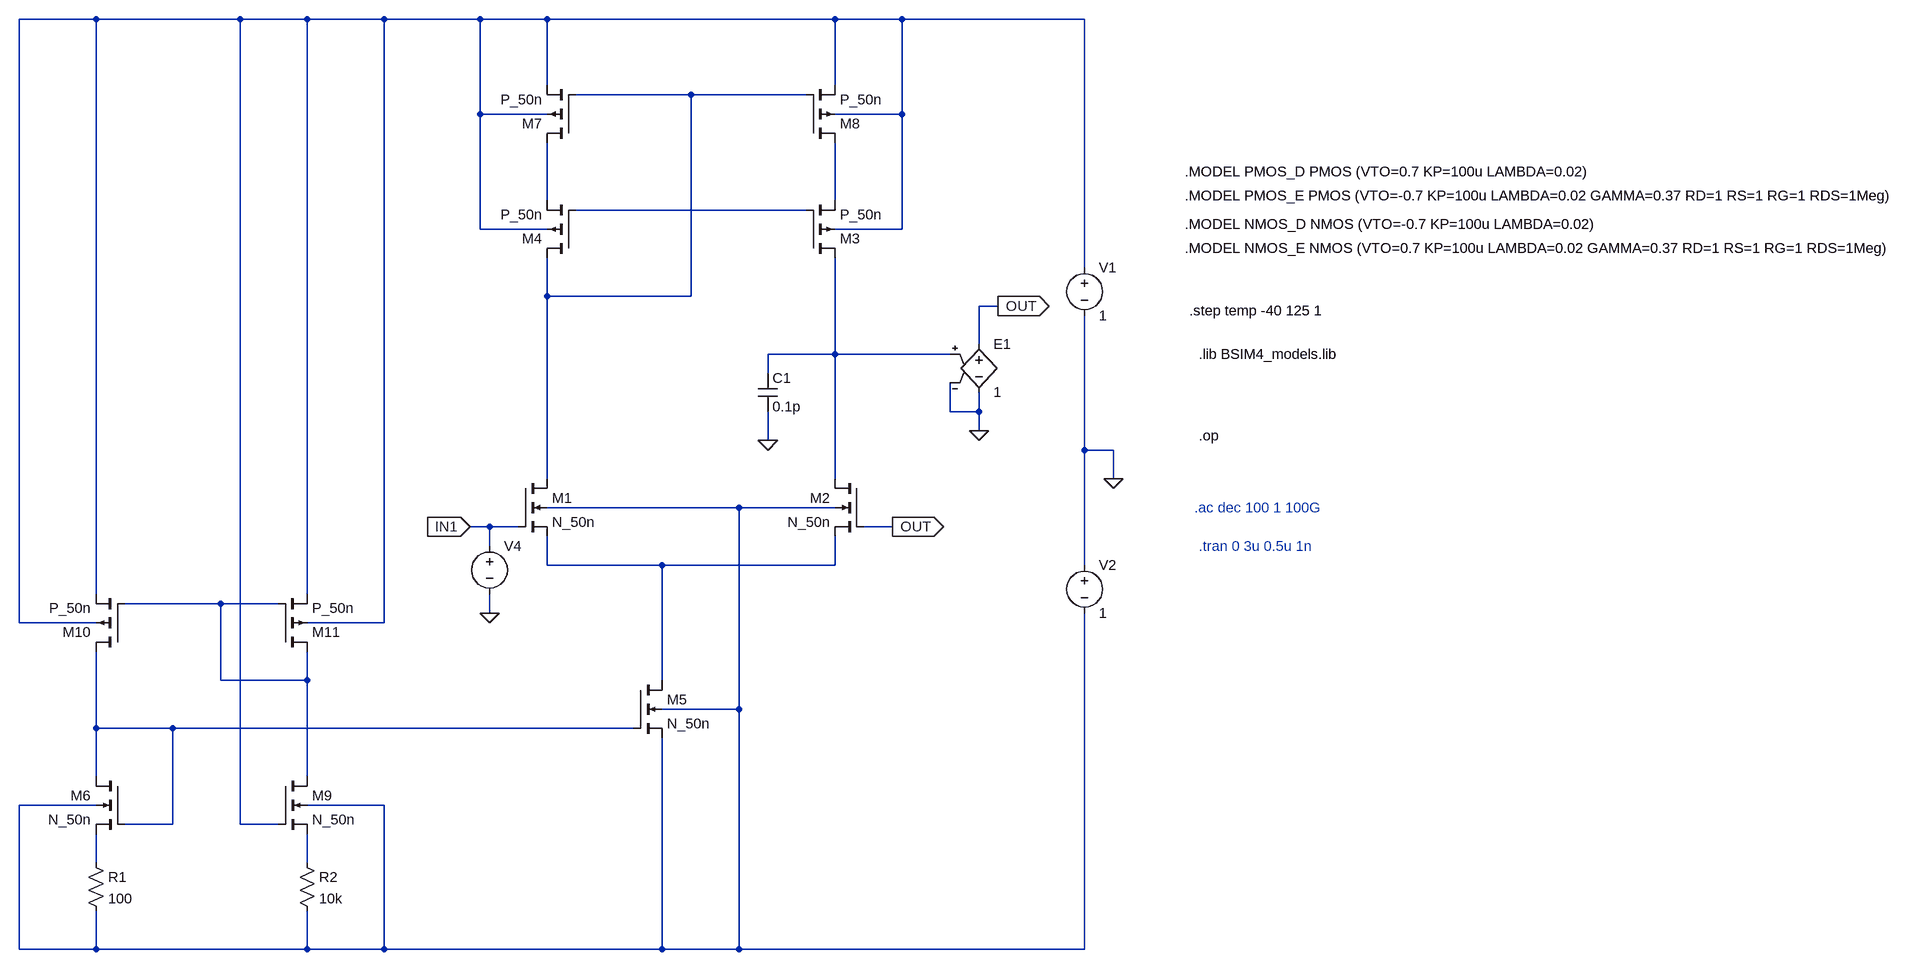
[diagram p0: schematic opamp_v3.asc]
opamp_v3.asc, the LTspice schematic file:
Version 4
SHEET 1 3416 1000
WIRE -736 -656 -864 -656
WIRE -496 -656 -736 -656
WIRE -384 -656 -496 -656
WIRE -256 -656 -384 -656
WIRE -96 -656 -256 -656
WIRE 16 -656 -96 -656
WIRE 496 -656 16 -656
WIRE 608 -656 496 -656
WIRE 912 -656 608 -656
WIRE 16 -496 16 -656
WIRE 496 -496 496 -656
WIRE 256 -480 64 -480
WIRE 448 -480 256 -480
WIRE -96 -448 -96 -656
WIRE 16 -448 -96 -448
WIRE 608 -448 608 -656
WIRE 608 -448 496 -448
WIRE 16 -304 16 -400
WIRE 496 -304 496 -400
WIRE 448 -288 64 -288
WIRE -96 -256 -96 -448
WIRE 16 -256 -96 -256
WIRE 608 -256 608 -448
WIRE 608 -256 496 -256
WIRE 912 -192 912 -656
WIRE 16 -144 16 -208
WIRE 256 -144 256 -480
WIRE 256 -144 16 -144
WIRE 768 -128 736 -128
WIRE 736 -64 736 -128
WIRE 496 -48 496 -208
WIRE 496 -48 384 -48
WIRE 688 -48 496 -48
WIRE 384 -16 384 -48
WIRE 688 48 688 0
WIRE 736 48 736 16
WIRE 736 48 688 48
WIRE 736 80 736 48
WIRE 384 96 384 48
WIRE 912 112 912 -112
WIRE 960 112 912 112
WIRE 16 160 16 -144
WIRE 496 160 496 -48
WIRE 960 160 960 112
WIRE 336 208 16 208
WIRE 496 208 336 208
WIRE -80 240 -112 240
WIRE -32 240 -80 240
WIRE 592 240 544 240
WIRE -80 272 -80 240
WIRE 16 304 16 256
WIRE 208 304 16 304
WIRE 496 304 496 256
WIRE 496 304 208 304
WIRE 912 304 912 112
WIRE -736 352 -736 -656
WIRE -384 352 -384 -656
WIRE -528 368 -688 368
WIRE -432 368 -528 368
WIRE -80 384 -80 352
WIRE -864 400 -864 -656
WIRE -736 400 -864 400
WIRE -256 400 -256 -656
WIRE -256 400 -384 400
WIRE -528 496 -528 368
WIRE -384 496 -384 448
WIRE -384 496 -528 496
WIRE 208 496 208 304
WIRE 336 544 336 208
WIRE 336 544 208 544
WIRE -736 576 -736 448
WIRE -608 576 -736 576
WIRE 160 576 -608 576
WIRE -736 656 -736 576
WIRE -384 656 -384 496
WIRE -736 704 -864 704
WIRE -256 704 -384 704
WIRE -608 736 -608 576
WIRE -608 736 -688 736
WIRE -496 736 -496 -656
WIRE -432 736 -496 736
WIRE -736 800 -736 752
WIRE -384 800 -384 752
WIRE -864 944 -864 704
WIRE -736 944 -736 880
WIRE -736 944 -864 944
WIRE -384 944 -384 880
WIRE -384 944 -736 944
WIRE -256 944 -256 704
WIRE -256 944 -384 944
WIRE 208 944 208 592
WIRE 208 944 -256 944
WIRE 336 944 336 544
WIRE 336 944 208 944
WIRE 912 944 912 384
WIRE 912 944 336 944
FLAG 960 160 0
FLAG -112 240 IN1
IOPIN -112 240 In
FLAG 768 -128 OUT
IOPIN 768 -128 Out
FLAG -80 384 0
FLAG 736 80 0
FLAG 592 240 OUT
IOPIN 592 240 Out
FLAG 384 96 0
DATAFLAG 16 0 ""
DATAFLAG 608 -48 ""
DATAFLAG 800 -656 ""
DATAFLAG 784 944 ""
DATAFLAG 192 304 ""
DATAFLAG 80 480 "Id(M5)"
DATAFLAG -80 576 ""
SYMBOL voltage 912 -208 R0
SYMATTR InstName V1
SYMATTR Value 1
SYMBOL voltage 912 288 R0
WINDOW 123 0 0 Left 0
WINDOW 39 0 0 Left 0
SYMATTR InstName V2
SYMATTR Value 1
SYMBOL voltage -80 256 R0
WINDOW 39 0 0 Left 0
WINDOW 3 24 96 Invisible 2
SYMATTR Value PULSE(0 0.5 1u 1f 1f 1u 4u)
SYMATTR Value2 AC 0.5 0
SYMATTR InstName V4
SYMBOL e 736 -80 R0
SYMATTR InstName E1
SYMATTR Value 1
SYMBOL cap 368 -16 R0
SYMATTR InstName C1
SYMATTR Value 0.1p
SYMBOL nmos4 160 496 R0
SYMATTR InstName M5
SYMATTR Value N_50n
SYMATTR Value2 l=50n w=550n
SYMBOL nmos4 -32 160 R0
SYMATTR InstName M1
SYMATTR Value N_50n
SYMATTR Value2 l=150n w=2000n
SYMBOL nmos4 544 160 M0
SYMATTR InstName M2
SYMATTR Value N_50n
SYMATTR Value2 l=150n w=2000n
SYMBOL pmos4 448 -208 M180
SYMATTR InstName M3
SYMATTR Value P_50n
SYMATTR Value2 l=50n w=1000n
SYMBOL pmos4 64 -208 R180
SYMATTR InstName M4
SYMATTR Value P_50n
SYMATTR Value2 l=50n w=1000n
SYMBOL nmos4 -688 656 M0
SYMATTR InstName M6
SYMATTR Value N_50n
SYMATTR Value2 l=50n w=500n
SYMBOL pmos4 64 -400 R180
SYMATTR InstName M7
SYMATTR Value P_50n
SYMATTR Value2 l=50n w=1000n
SYMBOL pmos4 448 -400 M180
SYMATTR InstName M8
SYMATTR Value P_50n
SYMATTR Value2 l=50n w=1000n
SYMBOL nmos4 -432 656 R0
SYMATTR InstName M9
SYMATTR Value N_50n
SYMATTR Value2 l=50n w=500n
SYMBOL pmos4 -688 448 R180
SYMATTR InstName M10
SYMATTR Value P_50n
SYMATTR Value2 l=50n w=1000n
SYMBOL pmos4 -432 448 M180
SYMATTR InstName M11
SYMATTR Value P_50n
SYMATTR Value2 l=50n w=1000n
SYMBOL res -752 784 R0
SYMATTR InstName R1
SYMATTR Value 100
SYMBOL res -400 784 R0
SYMATTR InstName R2
SYMATTR Value 10k
TEXT 1648 88 Left 2 !.op
TEXT 1640 208 Left 2 ;.ac dec 100 1 100G
TEXT 1624 -224 Left 2 !.MODEL NMOS_E NMOS (VTO=0.7 KP=100u LAMBDA=0.02 GAMMA=0.37 RD=1 RS=1 RG=1 RDS=1Meg)
TEXT 1624 -264 Left 2 !.MODEL NMOS_D NMOS (VTO=-0.7 KP=100u LAMBDA=0.02)
TEXT 1624 -312 Left 2 !.MODEL PMOS_E PMOS (VTO=-0.7 KP=100u LAMBDA=0.02 GAMMA=0.37 RD=1 RS=1 RG=1 RDS=1Meg)
TEXT 1624 -352 Left 2 !.MODEL PMOS_D PMOS (VTO=0.7 KP=100u LAMBDA=0.02)
TEXT 1648 272 Left 2 ;.tran 0 3u 0.5u 1n
TEXT 1632 -120 Left 2 !.step temp -40 125 1
TEXT 1648 -48 Left 2 !.lib BSIM4_models.lib

The netlist it stands for:
* opamp_v3.asc
V1 N001 0 1
V2 0 N007 1
V4 IN1 0 PULSE(0 0.5 1u 1f 1f 1u 4u) AC 0.5 0
E1 OUT 0 N006 0 1
C1 N006 0 0.1p
M5 N008 N010 N007 N007 N_50n l=50n w=550n
M1 N002 IN1 N008 N007 N_50n l=150n w=2000n
M2 N006 OUT N008 N007 N_50n l=150n w=2000n
M3 N006 N005 N004 N001 P_50n l=50n w=1000n
M4 N002 N005 N003 N001 P_50n l=50n w=1000n
M6 N010 N010 N011 N007 N_50n l=50n w=500n
M7 N003 N002 N001 N001 P_50n l=50n w=1000n
M8 N004 N002 N001 N001 P_50n l=50n w=1000n
M9 N009 N001 N012 N007 N_50n l=50n w=500n
M10 N010 N009 N001 N001 P_50n l=50n w=1000n
M11 N009 N009 N001 N001 P_50n l=50n w=1000n
R1 N011 N007 100
R2 N012 N007 10k
.model NMOS NMOS
.model PMOS PMOS
.lib standard.mos
.op
* .ac dec 100 1 100G
.MODEL NMOS_E NMOS (VTO=0.7 KP=100u LAMBDA=0.02 GAMMA=0.37 RD=1 RS=1 RG=1 RDS=1Meg)
.MODEL NMOS_D NMOS (VTO=-0.7 KP=100u LAMBDA=0.02)
.MODEL PMOS_E PMOS (VTO=-0.7 KP=100u LAMBDA=0.02 GAMMA=0.37 RD=1 RS=1 RG=1 RDS=1Meg)
.MODEL PMOS_D PMOS (VTO=0.7 KP=100u LAMBDA=0.02)
* .tran 0 3u 0.5u 1n
.step temp -40 125 1
.lib BSIM4_models.lib
.backanno
.end